# Altium schematic sheet RF.SchDoc: RF
size A4; Date: 2016/01/05; Author: Samuel López; DocumentNumber: 5; SheetNumber: 5; SheetTotal: 7; Project: H2H Main Board
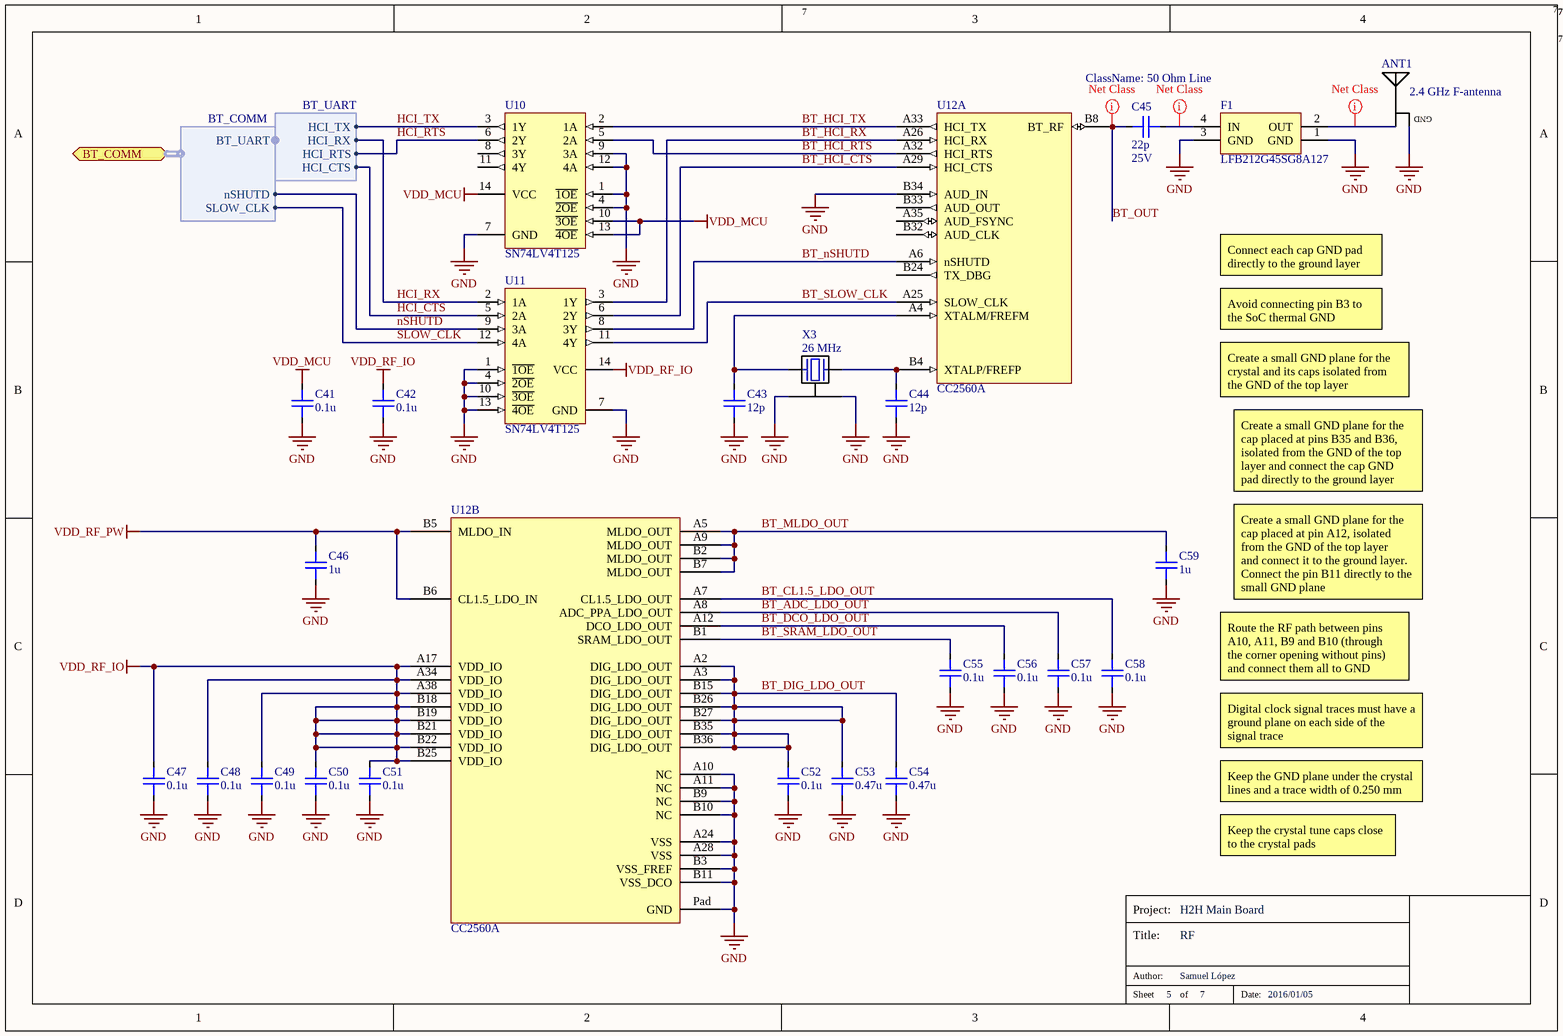
[diagram p0: RF.SchDoc]

## Parts
ANT1  2.4 GHz F-antenna  [Antenna Inverted F 2.4 GHz]  (net tie, no BOM)
C41  0.1u  [C0603]
C42  0.1u  [C0603]
C43  12p  [C0402]
C44  12p  [C0402]
C45  22p  Rated Voltage: 25V  [C0402]
C46  1u  [C0402]
C47  0.1u  [C0402]
C48  0.1u  [C0402]
C49  0.1u  [C0402]
C50  0.1u  [C0402]
C51  0.1u  [C0402]
C52  0.1u  [C0402]
C53  0.47u  [C0402]
C54  0.47u  [C0402]
C55  0.1u  [C0402]
C56  0.1u  [C0402]
C57  0.1u  [C0402]
C58  0.1u  [C0402]
C59  1u  [C0402]
F1  LFB212G45SG8A127  [LFB212G45SG8A127]
U10  SN74LV4T125  [SN74LV4T125]
U11  SN74LV4T125  [SN74LV4T125]
U12  CC2560A  [CC256x]  (parts A,B of 2)
X3  Frequency: 26 MHz  [NX2016SA]  (hidden comment: NX2016SA)

## Ports
BT_COMM (harness BT_COMM)

## Harnesses
BT_COMM: BT_UART, nSHUTD, SLOW_CLK
BT_UART: HCI_TX, HCI_RX, HCI_RTS, HCI_CTS

## Nets
GND: ANT1.2(GND) C41.1 C42.1 C43.1 C44.1 C46.1 C47.1 C48.1 C49.1 C50.1 C51.1 C52.1 C53.1 C54.1 C55.1 C56.1 C57.1 C58.1 C59.1 F1.1(GND) F1.3(GND) U10.1(~{1OE}) U10.4(~{2OE}) U10.7(GND) U10.9(3A) U10.12(4A) U11.1(~{1OE}) U11.4(~{2OE}) U11.7(GND) U11.10(~{3OE}) U11.13(~{4OE}) U12.A10(NC) U12.A11(NC) U12.A24(VSS) U12.A28(VSS) U12.B3(VSS_FREF) U12.B9(NC) U12.B10(NC) U12.B11(VSS_DCO) U12.B34(AUD_IN) U12.Pad(GND) X3.2 X3.4
VDD_MCU: C41.2 U10.10(~{3OE}) U10.13(~{4OE}) U10.14(VCC)
VDD_RF_IO: C42.2 C47.2 C48.2 C49.2 C50.2 C51.2 U11.14(VCC) U12.A17(VDD_IO) U12.A34(VDD_IO) U12.A38(VDD_IO) U12.B18(VDD_IO) U12.B19(VDD_IO) U12.B21(VDD_IO) U12.B22(VDD_IO) U12.B25(VDD_IO)
VDD_RF_PW: C46.2 U12.B5(MLDO_IN) U12.B6(CL1.5_LDO_IN)
BT_ADC_LDO_OUT: C57.2 U12.A8(ADC_PPA_LDO_OUT)
BT_CL1.5_LDO_OUT: C58.2 U12.A7(CL1.5_LDO_OUT)
BT_DCO_LDO_OUT: C56.2 U12.A12(DCO_LDO_OUT)
BT_DIG_LDO_OUT: C52.2 C53.2 C54.2 U12.A2(DIG_LDO_OUT) U12.A3(DIG_LDO_OUT) U12.B15(DIG_LDO_OUT) U12.B26(DIG_LDO_OUT) U12.B27(DIG_LDO_OUT) U12.B35(DIG_LDO_OUT) U12.B36(DIG_LDO_OUT)
BT_HCI_CTS: U11.6(2Y) U12.A29(HCI_CTS)
BT_HCI_RTS: U10.5(2A) U12.A32(HCI_RTS)
BT_HCI_RX: U11.3(1Y) U12.A26(HCI_RX)
BT_HCI_TX: U10.2(1A) U12.A33(HCI_TX)
BT_MLDO_OUT: C59.2 U12.A5(MLDO_OUT) U12.A9(MLDO_OUT) U12.B2(MLDO_OUT) U12.B7(MLDO_OUT)
BT_nSHUTD: U11.8(3Y) U12.A6(nSHUTD)
BT_OUT: C45.1 U12.B8(BT_RF)
BT_SLOW_CLK: U11.11(4Y) U12.A25(SLOW_CLK)
BT_SRAM_LDO_OUT: C55.2 U12.B1(SRAM_LDO_OUT)
HCI_CTS: U11.5(2A) ; harness BT_UART.HCI_CTS
HCI_RTS: U10.6(2Y) ; harness BT_UART.HCI_RTS
HCI_RX: U11.2(1A) ; harness BT_UART.HCI_RX
HCI_TX: U10.3(1Y) ; harness BT_UART.HCI_TX
nSHUTD: U11.9(3A) ; port BT_COMM.nSHUTD
SLOW_CLK: U11.12(4A) ; port BT_COMM.SLOW_CLK
NetANT1_1: ANT1.1(IN) F1.2(OUT)
NetC43_2: C43.2 U12.A4(XTALM/FREFM) X3.1
NetC44_2: C44.2 U12.B4(XTALP/FREFP) X3.3
NetC45_2: C45.2 F1.4(IN)

Not connected (* = marked no-connect by the designer): U10 8(3Y) 11(4Y); U12 A35(AUD_FSYNC) B24(TX_DBG) B32(AUD_CLK) B33(AUD_OUT)

## Layout directives
net class 50 Ohm Line: BT_OUT, NetANT1_1, NetC45_2

## Notes on the sheet
- Connect each cap GND pad
  directly to the ground layer
- Avoid connecting pin B3 to
  the SoC thermal GND
- Create a small GND plane for the
  crystal and its caps isolated from
  the GND of the top layer
- Create a small GND plane for the
  cap placed at pins B35 and B36,
  isolated from the GND of the top
  layer and connect the cap GND
  pad directly to the ground layer
- Create a small GND plane for the
  cap placed at pin A12, isolated
  from the GND of the top layer
  and connect it to the ground layer.
  Connect the pin B11 directly to the
  small GND plane
- Route the RF path between pins
  A10, A11, B9 and B10 (through
  the corner opening without pins)
  and connect them all to GND
- Digital clock signal traces must have a
  ground plane on each side of the
  signal trace
- Keep the GND plane under the crystal
  lines and a trace width of 0.250 mm
- Keep the crystal tune caps close
  to the crystal pads
- Project:
- Title:
- Sheet
- Author:
- of
- Date:

## Library data of the parts
ANT1 = ANT 2.4 GHz: Antenna - Inverted F 2.4 GHz
C41-C59 = Capacitor
  C41 C42 C47-C52 C55-C58: Value: 0.1u; Rated Voltage: *
  C43 C44: Value: 12p; Rated Voltage: *
  C45: Value: 22p
  C46 C59: Value: 1u; Rated Voltage: *
  C53 C54: Value: 0.47u; Rated Voltage: *
F1 = LFB212G45SG8A127: Filter - RF 2.4 GHz; Supplier 1: Digi-Key; Supplier Part Number 1: 490-5021-1-ND
U10 U11 = SN74LV4T125: IC - Voltage Level Translator; Supplier 1: Digi-Key; Supplier Part Number 1: 296-40546-1-ND
U12 = CC2560A: IC - Bluetooth 4.0 controller (BR/EDR); Supplier 1: Farnell; Supplier Part Number 1: 2334559
X3 = NX2016SA: Crystal - 26 MHz; Supplier 1: Digi-Key; Supplier Part Number 1: 644-1220-1-ND